# EAGLE design zxld381-boost-driver-13mm (EAGLE 6.5.0)
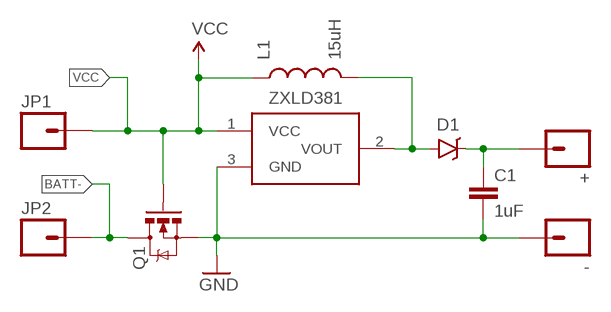
[diagram p0: schematic, sheet 1]

## Parts
+  M01PTH-KIT  [1X01-KIT]
-  M01NOSILK-KIT  [1X01NS-KIT]
C1  1uF  CAPACITOR-CERAMICC0805  [C0805]
D1  PMEG4005EJ  DIODE-SCHOTTKY-PMEG4005EJ  [SOD-323]
JP1  M01NOT-A-VIA-NOPE  [1X01_NOSILK_NOSTOP]
JP2  M01NOT-A-VIA-NOPE  [1X01_NOSILK_NOSTOP]
L1  15uH  INDUCTOR0805  [0805]
Q1  MOSFET-NCHANNELRYM002N05  [VMT3]
ZXLD381  ZXLD381  [SOT23-3]

## Nets
BATT-: JP2.P$1 Q1.3(D)
GND: -.1 C1.2 Q1.2(S) ZXLD381.3(GND)
N$2: D1.A L1.2 ZXLD381.2(VOUT)
N$3: +.1 C1.1 D1.C
VCC: JP1.P$1 L1.1 Q1.1(G) ZXLD381.1(VCC)

## Library data of the parts
+ - JP1 JP2 = A_butts:M01: Header 1 Standard 1-pin 0.1" header. Use with straight break away headers (SKU : PRT-00116), right angle break away headers (PRT-00553), swiss pins (PRT-00743), machine pins (PRT-00117), and female headers (PRT-00115).
C1 = A_butts:CAPACITOR-CERAMIC: CAPACITOR, European symbol
D1 = A_butts:DIODE-SCHOTTKY: Schottky diodes in SFE's production catalog BAT20J 1A 23V 0.62Vf RB751 120mA 40V 0.37Vf PMEG4005EJ 0.5A 40V 0.42Vf MBRA140 1A 40V 0.5Vf B340A 3A 40V SMA; PROD_ID: DIO-10955
L1 = A_butts:INDUCTOR: Inductors Basic Inductor/Choke - 0603 and 1206. Footprints are not proven and vary greatly between part numbers. SRN6045- 33uH, 20% 1.4A SDR0403-560KL - 56uH, 10%, 500mA RMS/740mA peak
Q1 = A_butts:MOSFET-NCHANNEL: Common NMOSFET Parts MFG P/N Store ID Prod ID FDD8780 TRANS-09984 SI7820DN TRANS-11055 FDS6630A IC-08089 2N7002PW TRANS-11151 FQP30N06L COM-10213 TRANS-10060 BSS123LT1G TRANS-08345 BSS138 TRANS-00830 BS170 2N7000
ZXLD381 = A_butts:ZXLD381

## Board
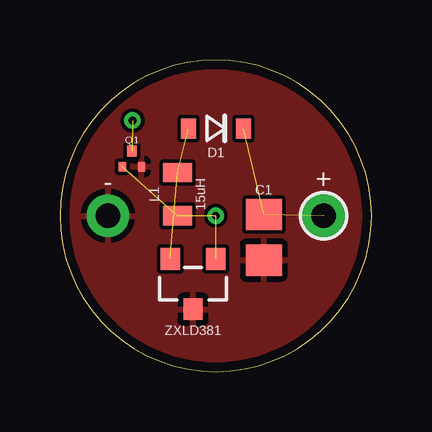
[diagram p1: board, top side]
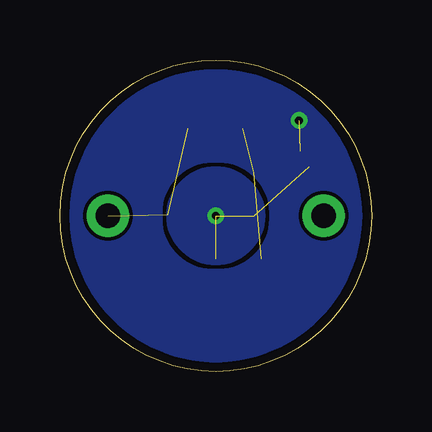
[diagram p2: board, bottom side, seen from below]

Size 13 x 13 mm. Coordinates in mm from the lower left corner, seen from the top.
Outline: 0,6.5 arc90 6.5,0 arc90 13,6.5 arc90 6.5,13 arc90 0,6.5
Copper layers (1*16): Top 0.0356mm / dielectric 1.5011mm / Bottom 0.0356mm
Design rules "LaenPCBOrder2": minimum track width 6mil, minimum drill 13mil, track to track 6mil, track to pad 6mil, pad to pad 6mil, via to via 6mil, smd to smd 6mil, copper to edge 15mil, drill to drill 6mil, minimum pad ring 7mil, minimum via ring 7mil, stop-mask expansion 3mil, vias tented up to drill 20mil, thermal gap 10mil

### Footprints (pad centres in the part's own frame; a part is rotated, then mirrored left to right if it is on the bottom)
1X01-KIT = drill 1.016 pad 1.778: 1 0,0
1X01NS-KIT = drill 1.016 pad 1.778: 1 0,0
C0805 = smd 1.3 x 1.5: 1 -0.95,0; 2 0.95,0
SOD-323 = smd 0.63 x 0.83: A 1.15,0; C -1.15,0
1X01_NOSILK_NOSTOP = drill 0.33: P$1 0,0
0805 = smd 0.8 x 1.2: 1 -0.9,0; 2 0.9,0
VMT3 = smd 0.3 x 0.4: 1 -0.4,-0.35; 2 0.4,-0.35 | smd 0.4 x 0.45: 3 0,0.3
SOT23-3 = smd 0.8 x 0.9: 1 -0.95,-1; 2 0.95,-1; 3 0,1.1

### Placement (x,y rotation side)
+  11,6.5 0 top
-  2,6.5 0 top
C1  8.5,5.6 270 top
D1  6.51,10.14 180 top
JP1  6.5,6.5 0 top
JP2  3.03,10.47 0 top
L1  4.9,7.4 90 top
Q1  3,8.9 0 top
ZXLD381  5.55,3.7 180 top

### Tracks (layer width: path | path; a pad name or v marks a point on that pad's centre or on a via)
BATT-  (1 unrouted)
  pour Bottom (rank 6): 6.5,0 arc-90 0,6.5 arc-90 6.5,13 arc-90 13,6.5 arc-90
GND
  pour Top (rank 6): 6.5,0 arc-90 0,6.5 arc-90 6.5,13 arc-90 13,6.5 arc-90
N$2  (2 unrouted)
N$3  (2 unrouted)
VCC  (3 unrouted)
  pour Bottom: 6.5,4.5 arc-90 4.5,6.5 arc-90 6.5,8.5 arc-90 8.5,6.5 arc-90